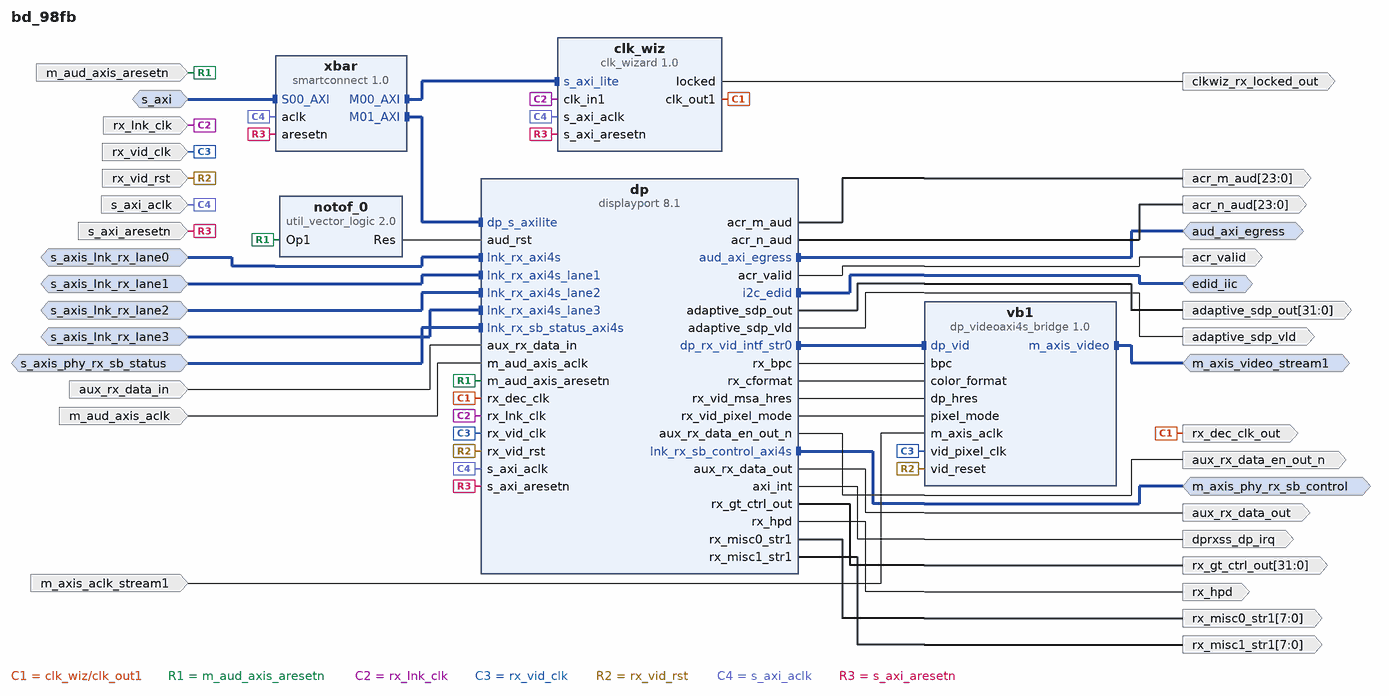
[diagram p0: block diagram of the top level]
# Vivado block design bd_98fb, xcvc1902-vsva2197-2MP-e-S, Vivado 2023.2
create_bd_design bd_98fb

create_bd_intf_port -mode Slave -vlnv xilinx.com:interface:aximm_rtl:1.0 s_axi
set_property -dict [list \
  CONFIG.ADDR_WIDTH 15 \
  CONFIG.DATA_WIDTH 32 \
  CONFIG.NUM_READ_OUTSTANDING 1 \
  CONFIG.NUM_WRITE_OUTSTANDING 1 \
  CONFIG.PROTOCOL AXI4LITE \
  CONFIG.master_id 1 \
] [get_bd_intf_ports s_axi]
create_bd_intf_port -mode Slave -vlnv xilinx.com:interface:axis_rtl:1.0 s_axis_phy_rx_sb_status
create_bd_intf_port -mode Master -vlnv xilinx.com:interface:axis_rtl:1.0 m_axis_phy_rx_sb_control
create_bd_intf_port -mode Slave -vlnv xilinx.com:interface:axis_rtl:1.0 s_axis_lnk_rx_lane0
set_property -dict {CONFIG.FREQ_HZ 506250000} [get_bd_intf_ports s_axis_lnk_rx_lane0]
create_bd_intf_port -mode Slave -vlnv xilinx.com:interface:axis_rtl:1.0 s_axis_lnk_rx_lane1
set_property -dict {CONFIG.FREQ_HZ 506250000} [get_bd_intf_ports s_axis_lnk_rx_lane1]
create_bd_intf_port -mode Slave -vlnv xilinx.com:interface:axis_rtl:1.0 s_axis_lnk_rx_lane2
set_property -dict {CONFIG.FREQ_HZ 506250000} [get_bd_intf_ports s_axis_lnk_rx_lane2]
create_bd_intf_port -mode Slave -vlnv xilinx.com:interface:axis_rtl:1.0 s_axis_lnk_rx_lane3
set_property -dict {CONFIG.FREQ_HZ 506250000} [get_bd_intf_ports s_axis_lnk_rx_lane3]
create_bd_intf_port -mode Master -vlnv xilinx.com:interface:iic_rtl:1.0 edid_iic
create_bd_intf_port -mode Master -vlnv xilinx.com:interface:axis_rtl:1.0 aud_axi_egress
set_property -dict {CONFIG.HAS_TKEEP 0 CONFIG.HAS_TLAST 0} [get_bd_intf_ports aud_axi_egress]
create_bd_intf_port -mode Master -vlnv xilinx.com:interface:axis_rtl:1.0 m_axis_video_stream1
set_property -dict {CONFIG.HAS_TKEEP 0} [get_bd_intf_ports m_axis_video_stream1]
create_bd_port -dir I -type clk s_axi_aclk
set_property -dict [list \
  CONFIG.ASSOCIATED_BUSIF m_axis_phy_rx_sb_control:s_axi:s_axis_phy_rx_sb_status \
  CONFIG.ASSOCIATED_RESET s_axi_aresetn \
] [get_bd_ports s_axi_aclk]
create_bd_port -dir I -type rst s_axi_aresetn
set_property -dict {CONFIG.POLARITY ACTIVE_LOW} [get_bd_ports s_axi_aresetn]
create_bd_port -dir I -type clk rx_vid_clk
set_property -dict {CONFIG.ASSOCIATED_RESET rx_vid_rst} [get_bd_ports rx_vid_clk]
create_bd_port -dir I -type rst rx_vid_rst
set_property -dict {CONFIG.POLARITY ACTIVE_HIGH} [get_bd_ports rx_vid_rst]
create_bd_port -dir I -type clk m_axis_aclk_stream1
create_bd_port -dir I aux_rx_data_in
create_bd_port -dir O aux_rx_data_out
create_bd_port -dir O aux_rx_data_en_out_n
create_bd_port -dir I -type clk rx_lnk_clk
set_property -dict [list \
  CONFIG.ASSOCIATED_BUSIF s_axis_lnk_rx_lane0:s_axis_lnk_rx_lane1:s_axis_lnk_rx_lane2:s_axis_lnk_rx_lane3 \
  CONFIG.FREQ_HZ 506250000 \
] [get_bd_ports rx_lnk_clk]
create_bd_port -dir O rx_dec_clk_out
set_property -dict {CONFIG.FREQ_HZ 405000000 CONFIG.PHASE 0.0} [get_bd_ports rx_dec_clk_out]
create_bd_port -dir O clkwiz_rx_locked_out
create_bd_port -dir O -type data rx_hpd
create_bd_port -dir O -type intr dprxss_dp_irq
create_bd_port -dir O -from 31 -to 0 rx_gt_ctrl_out
create_bd_port -dir O -from 7 -to 0 rx_misc0_str1
create_bd_port -dir O -from 7 -to 0 rx_misc1_str1
create_bd_port -dir O -from 31 -to 0 adaptive_sdp_out
create_bd_port -dir O -type data adaptive_sdp_vld
create_bd_port -dir I -type clk m_aud_axis_aclk
set_property -dict [list \
  CONFIG.ASSOCIATED_BUSIF aud_axi_egress \
  CONFIG.ASSOCIATED_RESET m_aud_axis_aresetn \
] [get_bd_ports m_aud_axis_aclk]
create_bd_port -dir I -type rst m_aud_axis_aresetn
set_property -dict {CONFIG.POLARITY ACTIVE_LOW} [get_bd_ports m_aud_axis_aresetn]
create_bd_port -dir O -from 23 -to 0 acr_m_aud
create_bd_port -dir O -from 23 -to 0 acr_n_aud
create_bd_port -dir O -type data acr_valid

create_bd_cell -type ip -vlnv xilinx.com:ip:displayport:8.1 dp
set_property -dict [list \
  CONFIG.C_VERSAL true \
  CONFIG.Data_flow_direction Receive_Sink_Core \
  CONFIG.ENABLE_8B10B_DEC true \
  CONFIG.ENABLE_DSC 0 \
  CONFIG.Enable_HDCP22_Encryption_Hooks false \
  CONFIG.Enable_HDCP_Encryption_Hooks false \
  CONFIG.Enable_of_Audio_Channels true \
  CONFIG.GT_Data_Width 2 \
  CONFIG.INCLUDE_CLK_RECOV_SUPPORT 0 \
  CONFIG.INCLUDE_FEC_PORTS 0 \
  CONFIG.INCLUDE_VID_EDID 0 \
  CONFIG.Link_Rate 8.1 \
  CONFIG.MST_Enable false \
  CONFIG.Max_Bits_Per_Color 10 \
  CONFIG.Number_of_Audio_Channels 2 \
  CONFIG.Number_of_Lanes 4 \
  CONFIG.PHY_type_External External_phy \
  CONFIG.Protocol_Selection DP_1_3 \
  CONFIG.Quad_Pixel_Enable true \
  CONFIG.SIM_Mode false \
  CONFIG.SS_Mode true \
  CONFIG.YCRCB_Enable true \
  CONFIG.YOnly_Enable true \
  CONFIG.aux_io_loc 1 \
  CONFIG.aux_io_type 0 \
  CONFIG.eDP_Enable false \
] [get_bd_cells dp]
create_bd_cell -type ip -vlnv xilinx.com:ip:clk_wizard:1.0 clk_wiz
set_property -dict [list \
  CONFIG.CLKOUT_REQUESTED_OUT_FREQUENCY 405.000,100.000,100.000,100.000,100.000,100.000,100.000 \
  CONFIG.CLKOUT_USED true,false,false,false,false,false,false \
  CONFIG.PRIM_IN_FREQ 506.250 \
  CONFIG.PRIM_SOURCE No_buffer \
  CONFIG.USE_DYN_RECONFIG true \
] [get_bd_cells clk_wiz]
create_bd_cell -type ip -vlnv xilinx.com:ip:smartconnect:1.0 xbar
set_property -dict {CONFIG.NUM_MI 2 CONFIG.NUM_SI 1} [get_bd_cells xbar]
create_bd_cell -type ip -vlnv xilinx.com:ip:dp_videoaxi4s_bridge:1.0 vb1
set_property -dict [list \
  CONFIG.C_ENABLE_420_FOR_MAX_8k30 false \
  CONFIG.C_ENABLE_420_FOR_MAX_8k60 false \
  CONFIG.C_ENABLE_DSC false \
  CONFIG.C_ENABLE_DSC_DUMMY_BYTES_IN_RX false \
  CONFIG.C_ENABLE_INTERNAL_REMAP true \
  CONFIG.C_MAX_BPC 10 \
  CONFIG.C_M_AXIS_VIDEO_TDATA_WIDTH 120 \
  CONFIG.C_M_AXIS_VIDEO_TDATA_WIDTH_BRIDGE_OUTPUT 120 \
  CONFIG.C_PPC 4 \
  CONFIG.C_START_DSC_BYTE_FROM_LSB true \
  CONFIG.C_UG934_COMPLIANCE true \
] [get_bd_cells vb1]
create_bd_cell -type ip -vlnv xilinx.com:ip:util_vector_logic:2.0 notof_0
set_property -dict {CONFIG.C_OPERATION not CONFIG.C_SIZE 1} [get_bd_cells notof_0]

# ---- connections ----

connect_bd_intf_net [get_bd_intf_ports aud_axi_egress] [get_bd_intf_pins dp/aud_axi_egress]
connect_bd_intf_net [get_bd_intf_pins dp/dp_rx_vid_intf_str0] [get_bd_intf_pins vb1/dp_vid]
connect_bd_intf_net [get_bd_intf_pins dp/i2c_edid] [get_bd_intf_ports edid_iic]
connect_bd_intf_net [get_bd_intf_pins dp/lnk_rx_sb_control_axi4s] [get_bd_intf_ports m_axis_phy_rx_sb_control]
connect_bd_intf_net [get_bd_intf_ports s_axi] [get_bd_intf_pins xbar/S00_AXI]
connect_bd_intf_net -intf_net s_axis_lnk_rx_lane0_1 [get_bd_intf_pins dp/lnk_rx_axi4s] [get_bd_intf_ports s_axis_lnk_rx_lane0]
connect_bd_intf_net -intf_net s_axis_lnk_rx_lane1_1 [get_bd_intf_pins dp/lnk_rx_axi4s_lane1] [get_bd_intf_ports s_axis_lnk_rx_lane1]
connect_bd_intf_net -intf_net s_axis_lnk_rx_lane2_1 [get_bd_intf_pins dp/lnk_rx_axi4s_lane2] [get_bd_intf_ports s_axis_lnk_rx_lane2]
connect_bd_intf_net -intf_net s_axis_lnk_rx_lane3_1 [get_bd_intf_pins dp/lnk_rx_axi4s_lane3] [get_bd_intf_ports s_axis_lnk_rx_lane3]
connect_bd_intf_net [get_bd_intf_pins dp/lnk_rx_sb_status_axi4s] [get_bd_intf_ports s_axis_phy_rx_sb_status]
connect_bd_intf_net [get_bd_intf_pins vb1/m_axis_video] [get_bd_intf_ports m_axis_video_stream1]
connect_bd_intf_net [get_bd_intf_pins xbar/M00_AXI] [get_bd_intf_pins clk_wiz/s_axi_lite]
connect_bd_intf_net [get_bd_intf_pins xbar/M01_AXI] [get_bd_intf_pins dp/dp_s_axilite]
connect_bd_net [get_bd_ports aux_rx_data_in] [get_bd_pins dp/aux_rx_data_in]
connect_bd_net [get_bd_pins clk_wiz/clk_out1] [get_bd_pins dp/rx_dec_clk] [get_bd_ports rx_dec_clk_out]
connect_bd_net [get_bd_pins clk_wiz/locked] [get_bd_ports clkwiz_rx_locked_out]
connect_bd_net [get_bd_pins dp/acr_m_aud] [get_bd_ports acr_m_aud]
connect_bd_net [get_bd_pins dp/acr_n_aud] [get_bd_ports acr_n_aud]
connect_bd_net [get_bd_pins dp/acr_valid] [get_bd_ports acr_valid]
connect_bd_net [get_bd_pins dp/adaptive_sdp_out] [get_bd_ports adaptive_sdp_out]
connect_bd_net [get_bd_pins dp/adaptive_sdp_vld] [get_bd_ports adaptive_sdp_vld]
connect_bd_net [get_bd_pins dp/aux_rx_data_en_out_n] [get_bd_ports aux_rx_data_en_out_n]
connect_bd_net [get_bd_pins dp/aux_rx_data_out] [get_bd_ports aux_rx_data_out]
connect_bd_net [get_bd_pins dp/axi_int] [get_bd_ports dprxss_dp_irq]
connect_bd_net [get_bd_pins dp/rx_bpc] [get_bd_pins vb1/bpc]
connect_bd_net [get_bd_pins dp/rx_cformat] [get_bd_pins vb1/color_format]
connect_bd_net [get_bd_pins dp/rx_gt_ctrl_out] [get_bd_ports rx_gt_ctrl_out]
connect_bd_net [get_bd_pins dp/rx_hpd] [get_bd_ports rx_hpd]
connect_bd_net [get_bd_pins dp/rx_misc0_str1] [get_bd_ports rx_misc0_str1]
connect_bd_net [get_bd_pins dp/rx_misc1_str1] [get_bd_ports rx_misc1_str1]
connect_bd_net [get_bd_pins dp/rx_vid_msa_hres] [get_bd_pins vb1/dp_hres]
connect_bd_net [get_bd_pins dp/rx_vid_pixel_mode] [get_bd_pins vb1/pixel_mode]
connect_bd_net [get_bd_ports m_aud_axis_aclk] [get_bd_pins dp/m_aud_axis_aclk]
connect_bd_net [get_bd_ports m_aud_axis_aresetn] [get_bd_pins dp/m_aud_axis_aresetn] [get_bd_pins notof_0/Op1]
connect_bd_net -net m_axis_aclk_stream1_1 [get_bd_ports m_axis_aclk_stream1] [get_bd_pins vb1/m_axis_aclk]
connect_bd_net [get_bd_pins notof_0/Res] [get_bd_pins dp/aud_rst]
connect_bd_net [get_bd_ports rx_lnk_clk] [get_bd_pins dp/rx_lnk_clk] [get_bd_pins clk_wiz/clk_in1]
connect_bd_net [get_bd_ports rx_vid_clk] [get_bd_pins dp/rx_vid_clk] [get_bd_pins vb1/vid_pixel_clk]
connect_bd_net [get_bd_ports rx_vid_rst] [get_bd_pins dp/rx_vid_rst] [get_bd_pins vb1/vid_reset]
connect_bd_net [get_bd_ports s_axi_aclk] [get_bd_pins dp/s_axi_aclk] [get_bd_pins clk_wiz/s_axi_aclk] [get_bd_pins xbar/aclk]
connect_bd_net [get_bd_ports s_axi_aresetn] [get_bd_pins dp/s_axi_aresetn] [get_bd_pins clk_wiz/s_axi_aresetn] [get_bd_pins xbar/aresetn]

# ---- address map ----
assign_bd_address -offset 0x0000 -range 8K -target_address_space [get_bd_addr_spaces s_axi] [get_bd_addr_segs dp/dp_s_axilite/Reg]
assign_bd_address -offset 0x5000 -range 4K -target_address_space [get_bd_addr_spaces s_axi] [get_bd_addr_segs clk_wiz/s_axi_lite/Reg]

validate_bd_design
save_bd_design
